# Altium schematic sheet main.SchDoc
size A2; SheetNumber: 1; SheetTotal: 1
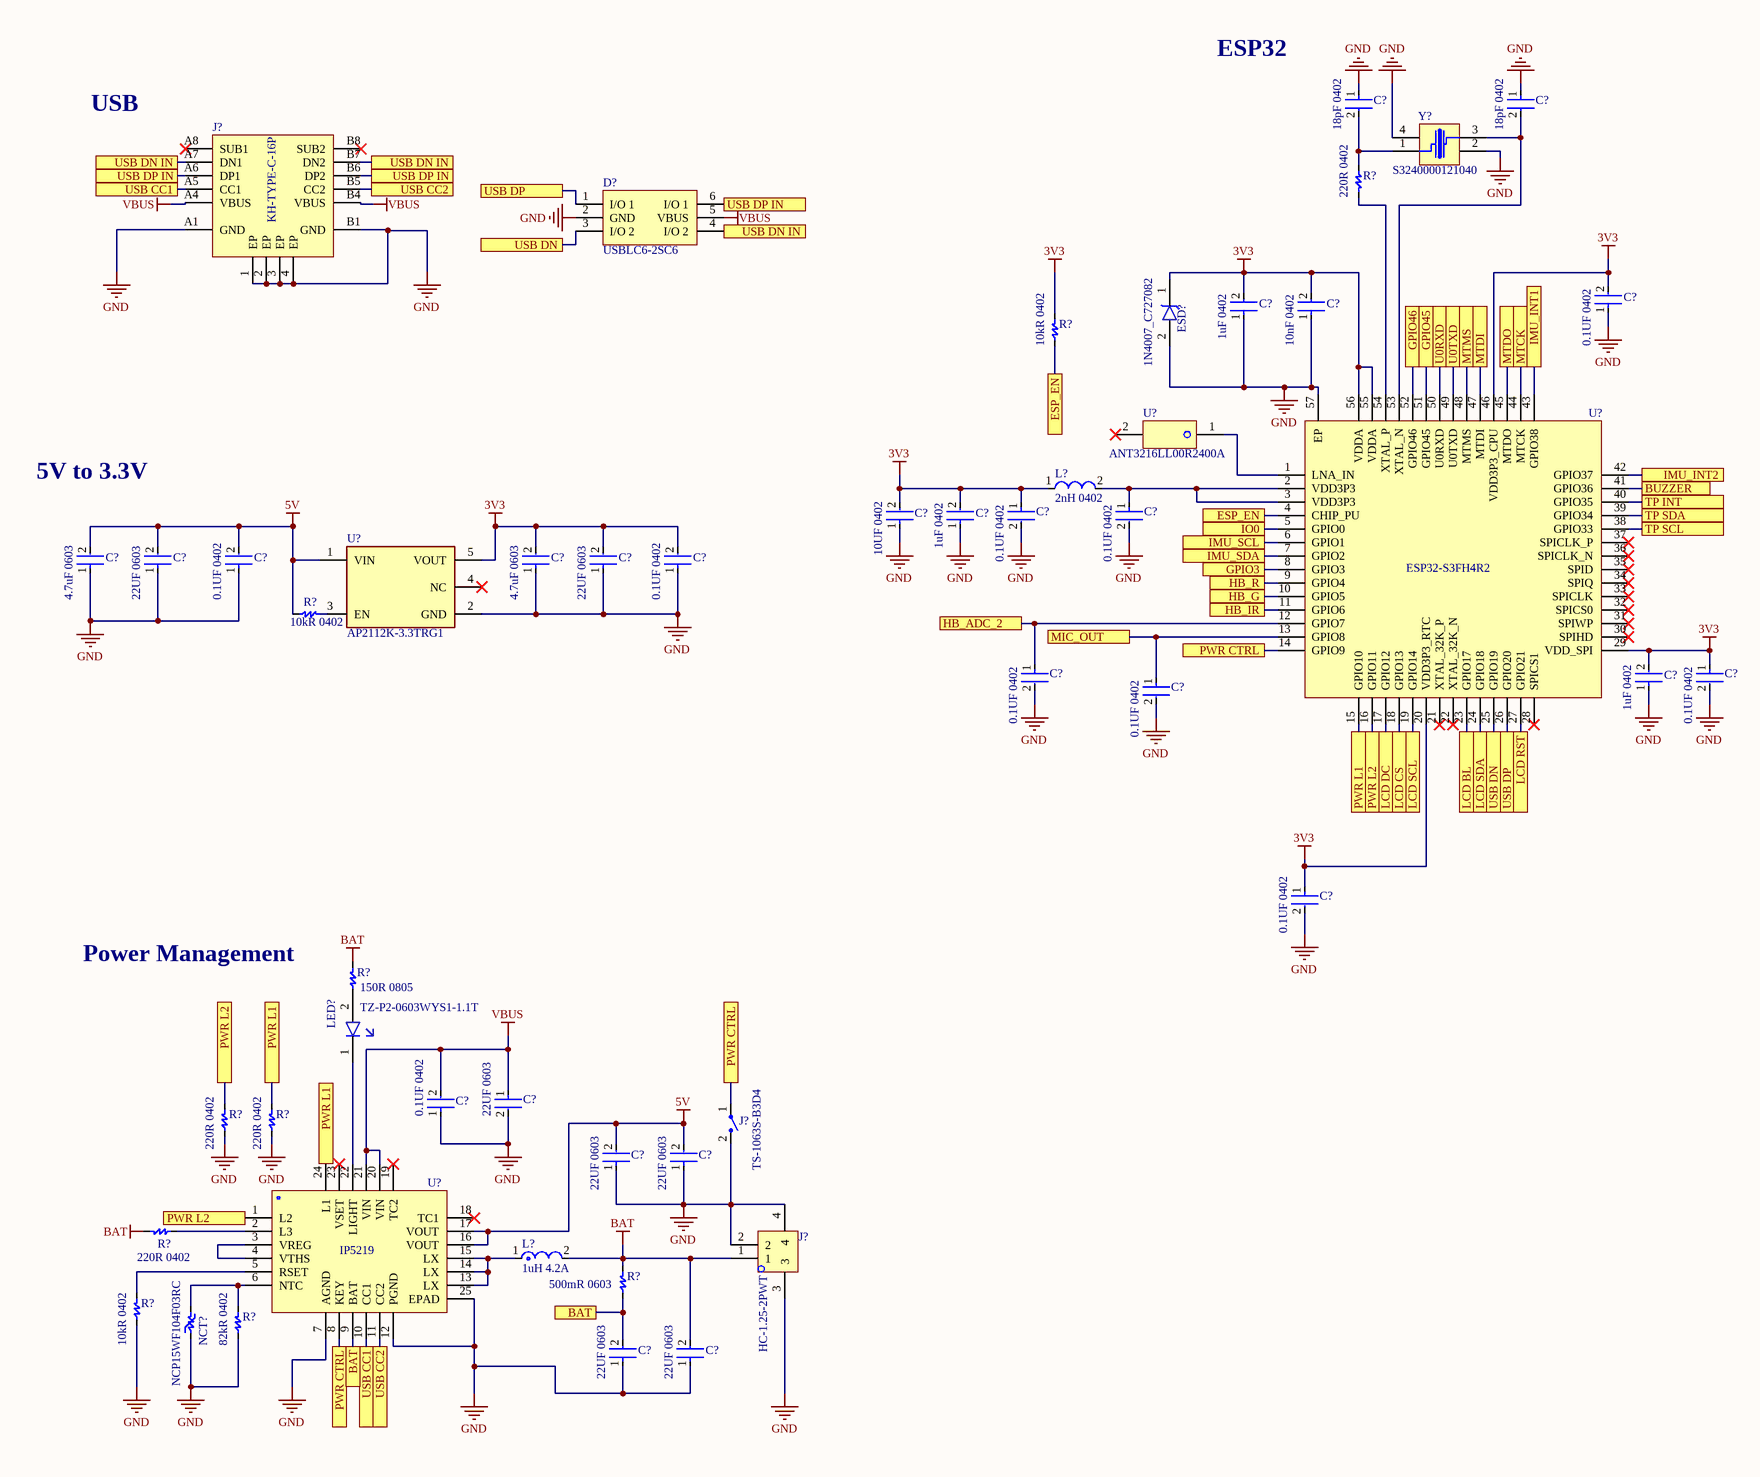
[diagram p0: main.SchDoc, left]
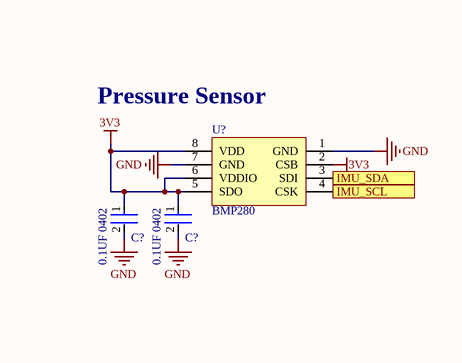
[diagram p1: main.SchDoc, right]

## Parts
(Parts that share a designator on the sheet are numbered #1, #2 ... from top to bottom, then left to right.)
C?#1  18pF 0402  [0402_C]
C?#2  18pF 0402  [0402_C]
C?#3  0.1UF 0402  [0402_C]
C?#4  0.1UF 0402  [0402_C]
C?#5  0.1UF 0402  [0402_C]
C?#6  1uF 0402  [0402_C]
C?#7  10nF 0402  [0402_C]
C?#8  0.1UF 0402  [0402_C]
C?#9  0.1UF 0402  [0402_C]
C?#10  10UF 0402  [0402_C]
C?#11  1uF 0402  [0402_C]
C?#12  4.7uF 0603  [0603_C]
C?#13  22UF 0603  [0603_C]
C?#14  0.1UF 0402  [0402_C]
C?#15  4.7uF 0603  [0603_C]
C?#16  22UF 0603  [0603_C]
C?#17  0.1UF 0402  [0402_C]
C?#18  0.1UF 0402  [0402_C]
C?#19  0.1UF 0402  [0402_C]
C?#20  0.1UF 0402  [0402_C]
C?#21  1uF 0402  [0402_C]
C?#22  0.1UF 0402  [0402_C]
C?#23  22UF 0603  [0603_C]
C?#24  0.1UF 0402  [0402_C]
C?#25  22UF 0603  [0603_C]
C?#26  22UF 0603  [0603_C]
C?#27  22UF 0603  [0603_C]
C?#28  22UF 0603  [0603_C]
D?  USBLC6-2SC6  [USBLC6-2SC6]
ESD?  1N4007_C727082  [1N4007_C727082]
J?#1  KH-TYPE-C-16P  [KH-TYPE-C-16P]
J?#2  TS-1063S-B3D4  [TS-1063S-B3D4]
J?#3  HC-1.25-2PWT  [HC-1.25-2PWT]
L?#1  2nH 0402  [0402_H]
L?#2  1uH 4.2A  [WPN252012H1R0MT]
LED?  TZ-P2-0603WYS1-1.1T  [TZ-P2-0603WYS1-1.1T]
NCT?  NCP15WF104F03RC  [0402_R]
R?#1  220R 0402  [0402_R]
R?#2  10kR 0402  [0402_R]
R?#3  10kR 0402  [0402_R]
R?#4  150R 0805  [0805_R]
R?#5  220R 0402  [0402_R]
R?#6  220R 0402  [0402_R]
R?#7  220R 0402  [0402_R]
R?#8  500mR 0603  [0603_R]
R?#9  10kR 0402  [0402_R]
R?#10  82kR 0402  [0402_R]
U?#1  BMP280  [BMP280]
U?#2  ESP32-S3FH4R2  [ESP32-S3FH4R2]
U?#3  ANT3216LL00R2400A  [ANT3216LL00R2400A]
U?#4  AP2112K-3.3TRG1  [AP2112K-3.3TRG1]
U?#5  IP5219  [IP5219]
Y?  S3240000121040  [S3240000121040]

## Ports
BAT, BUZZER, ESP_EN, GPIO3, GPIO45, GPIO46, HB_ADC_2, HB_G, HB_IR, HB_R, IMU_INT1, IMU_INT2, IMU_SCL, IMU_SDA, IO0, LCD BL, LCD CS, LCD DC, LCD RST, LCD SCL, LCD SDA, MIC_OUT, MTCK, MTDI, MTDO, MTMS, PWR CTRL, PWR L1, PWR L2, TP INT, TP SCL, TP SDA, U0RXD, U0TXD, USB CC1, USB CC2, USB DN, USB DN IN, USB DP, USB DP IN

## Nets
3V3: C?#3.1 C?#4.1 C?#5.2 C?#6.2 C?#7.2 C?#8.1 C?#10.2 C?#11.2 C?#15.2 C?#16.2 C?#17.2 C?#19.1 C?#21.2 C?#22.1 ESD?.1 L?#1.1 R?#2.2 U?#1.2(CSB) U?#1.5(SDO) U?#1.6(VDDIO) U?#1.8(VDD) U?#2.20(VDD3P3_RTC) U?#2.29(VDD_SPI) U?#2.46(VDD3P3_CPU) U?#2.55(VDDA) U?#2.56(VDDA) U?#4.5(VOUT)
5V: C?#12.2 C?#13.2 C?#14.2 C?#25.2 C?#26.2 R?#3.1 U?#4.1(VIN) U?#5.16(VOUT) U?#5.17(VOUT)
BAT: C?#28.2 J?#3.1 L?#2.2 R?#4.2 R?#7.2 R?#8.2
GND: C?#1.1 C?#2.1 C?#3.2 C?#4.2 C?#5.1 C?#6.1 C?#7.1 C?#8.2 C?#9.2 C?#10.1 C?#11.1 C?#12.1 C?#13.1 C?#14.1 C?#15.1 C?#16.1 C?#17.1 C?#18.2 C?#19.2 C?#20.2 C?#21.1 C?#22.2 C?#23.2 C?#24.1 C?#25.1 C?#26.1 C?#27.1 C?#28.1 D?.2(GND) ESD?.2 J?#1.1(EP) J?#1.2(EP) J?#1.3(EP) J?#1.4(EP) J?#1.A1(GND) J?#1.B1(GND) J?#2.2 J?#3.2 J?#3.3 J?#3.4 NCT?.1 R?#5.1 R?#6.1 R?#9.1 R?#10.1 U?#1.1(GND) U?#1.7(GND) U?#2.57(EP) U?#4.2(GND) U?#5.7(AGND) U?#5.12(PGND) U?#5.25(EPAD) Y?.2 Y?.4
VBUS: C?#23.1 C?#24.2 D?.5(VBUS) J?#1.A4(VBUS) J?#1.B4(VBUS) U?#5.20(VIN) U?#5.21(VIN)
BAT: C?#27.2 R?#8.1 U?#5.9(BAT) ; port BAT  [a separate net that carries the same name]
BUZZER: U?#2.41(GPIO36) ; port BUZZER
ESP_EN: R?#2.1 U?#2.4(CHIP_PU) ; port ESP_EN
GPIO3: U?#2.8(GPIO3) ; port GPIO3
GPIO45: U?#2.51(GPIO45) ; port GPIO45
GPIO46: U?#2.52(GPIO46) ; port GPIO46
HB_ADC_2: C?#18.1 U?#2.12(GPIO7) ; port HB_ADC_2
HB_G: U?#2.10(GPIO5) ; port HB_G
HB_IR: U?#2.11(GPIO6) ; port HB_IR
HB_R: U?#2.9(GPIO4) ; port HB_R
IMU_INT1: U?#2.43(GPIO38) ; port IMU_INT1
IMU_INT2: U?#2.42(GPIO37) ; port IMU_INT2
IMU_SCL: U?#1.4(CSK) U?#2.6(GPIO1) ; port IMU_SCL
IMU_SDA: U?#1.3(SDI) U?#2.7(GPIO2) ; port IMU_SDA
IO0: U?#2.5(GPIO0) ; port IO0
LCD BL: U?#2.23(GPIO17) ; port LCD BL
LCD CS: U?#2.18(GPIO13) ; port LCD CS
LCD DC: U?#2.17(GPIO12) ; port LCD DC
LCD RST: U?#2.27(GPIO21) ; port LCD RST
LCD SCL: U?#2.19(GPIO14) ; port LCD SCL
LCD SDA: U?#2.24(GPIO18) ; port LCD SDA
MIC_OUT: C?#20.1 U?#2.13(GPIO8) ; port MIC_OUT
MTCK: U?#2.44(MTCK) ; port MTCK
MTDI: U?#2.47(MTDI) ; port MTDI
MTDO: U?#2.45(MTDO) ; port MTDO
MTMS: U?#2.48(MTMS) ; port MTMS
PWR CTRL: J?#2.1 U?#2.14(GPIO9) U?#5.8(KEY) ; port PWR CTRL
PWR L1: R?#6.2 U?#2.15(GPIO10) U?#5.24(L1) ; port PWR L1
PWR L2: R?#5.2 U?#2.16(GPIO11) U?#5.1(L2) ; port PWR L2
TP INT: U?#2.40(GPIO35) ; port TP INT
TP SCL: U?#2.38(GPIO33) ; port TP SCL
TP SDA: U?#2.39(GPIO34) ; port TP SDA
U0RXD: U?#2.50(U0RXD) ; port U0RXD
U0TXD: U?#2.49(U0TXD) ; port U0TXD
USB CC1: J?#1.A5(CC1) U?#5.10(CC1) ; port USB CC1
USB CC2: J?#1.B5(CC2) U?#5.11(CC2) ; port USB CC2
USB DN: D?.3(I/O_2) U?#2.25(GPIO19) ; port USB DN
USB DN IN: D?.4(I/O_2) J?#1.A7(DN1) J?#1.B7(DN2) ; port USB DN IN
USB DP: D?.1(I/O_1) U?#2.26(GPIO20) ; port USB DP
USB DP IN: D?.6(I/O_1) J?#1.A6(DP1) J?#1.B6(DP2) ; port USB DP IN
NetC?#1_2: C?#1.2 R?#1.1 Y?.1
NetC?#2_2: C?#2.2 U?#2.53(XTAL_N) Y?.3
NetC?#9_1: C?#9.1 L?#1.2 U?#2.2(VDD3P3) U?#2.3(VDD3P3)
NetL?#2_1: L?#2.1 U?#5.13(LX) U?#5.14(LX) U?#5.15(LX)
NetLED?_1: LED?.1 U?#5.22(LIGHT)
NetLED?_2: LED?.2 R?#4.1
NetNCT?_2: NCT?.2 R?#10.2 U?#5.6(NTC)
NetR?#1_2: R?#1.2 U?#2.54(XTAL_P)
NetR?#3_2: R?#3.2 U?#4.3(EN)
NetR?#7_1: R?#7.1 U?#5.2(L3)
NetR?#9_2: R?#9.2 U?#5.5(RSET)
NetU?#2_1: U?#2.1(LNA_IN) U?#3.1
NetU?#5_3: U?#5.3(VREG) U?#5.4(VTHS)

Not connected (* = marked no-connect by the designer): J?#1 A8(SUB1)* B8(SUB2)*; U?#2 21(XTAL_32K_P)* 22(XTAL_32K_N)* 28(SPICS1)* 30(SPIHD)* 31(SPIWP)* 32(SPICS0)* 33(SPICLK)* 34(SPIQ)* 35(SPID)* 36(SPICLK_N)* 37(SPICLK_P)*; U?#3 2*; U?#4 4(NC)*; U?#5 18(TC1)* 19(TC2)* 23(VSET)*

## Notes on the sheet
- ESP32
- USB
- (near U?#1) Pressure Sensor
- 5V to 3.3V
- Power Management

## Library data of the parts
C?#1 C?#2 = CAP CER 18pF 50V X5R 0402: 18pF ±5% 50V; Manufacturer: FH; Manufacturer Part Number: 0402CG180J500NT; Supplier 1: LCSC; Category: Uncategorized; Supplier Part Number 1: C1549
C?#3-C?#5 C?#8 C?#9 C?#14 C?#17-C?#20 C?#22 C?#24 = CAP CER 0.1UF 25V X7R 0402: CGA Series 0402 100 nF 25 V ±10 % Tolerance X7R SMT Multilayer Ceramic Capacitor; Manufacturer: TDK; Manufacturer Part Number: CGA2B3X7R1E104K050BB; Tolerance: 10%; Capacitance: 100nF; Voltage Rating (DC): 25V; Supplier 1: Digi-Key; RoHS: Yes; Category: Ceramic Capacitors; Stock 1: 5051937; Pricing 1: 1=0.12, 10=0.084, 50=0.0478, 100=0.0395, 500=0.02772, 1000=0.02295, 2500=0.02136, 5000=0.01954 (USD); Mount: Surface Mount; Case/Package: 0402; Case Code (Metric): 1005; Case Code (Imperial): 0402; Weight: 2.3E-05oz; Min Operating Temperature: -55°C; Max Operating Temperature: 125°C; Packaging: Tape and Reel; Dielectric: X7R; Voltage: 25V; Voltage Rating: 25V; Package Quantity: 10000; Termination: SMD/SMT; Series: CGA; Length: 1mm; Width: 0.5mm; Height: 0.5mm; Depth: 0.5mm; Ratings: AEC-Q200; Lead Free: Lead Free; Reach SVHC Compliant: No; RoHS Compliant: Yes; ComponentLink1URL: https://datasheet.ciiva.com/24216/cga2b3x7r1e104k050bb-266280-24216396.pdf?src-supplier=Mouser; ComponentLink1Description: https://datasheet.ciiva.com/24216/cga2b3x7r1e104k050bb-266280-24216396.pdf?src-supplier=Mouser; ComponentLink2URL: https://datasheet.ciiva.com/22725/1735392-22725626.pdf?src-supplier=Element14; ComponentLink2Description: https://datasheet.ciiva.com/22725/1735392-22725626.pdf?src-supplier=Element14; ComponentLink3URL: https://datasheet.ciiva.com/28563/1735392-28563942.pdf?src-supplier=Element14; ComponentLink3Description: https://datasheet.ciiva.com/28563/1735392-28563942.pdf?src-supplier=Element14; ComponentLink4URL: https://datasheet.ciiva.com/23803/1936565-23803070.pdf?src-supplier=Newark; ComponentLink4Description: https://datasheet.ciiva.com/23803/1936565-23803070.pdf?src-supplier=Newark; Supplier Part Number 1: 445-6902-1-ND
C?#6 C?#11 C?#21 = CAP CER 1UF 25V X7R 0402: CAP CER 1UF 25V X5R 0402; Manufacturer: Samsung; Manufacturer Part Number: CL05A105KA5NQNC; Material: Ceramic; Tolerance: 10%; Supplier 1: Digi-Key; RoHS: Yes; Category: Ceramic Capacitors; Stock 1: 1706852; Pricing 1: 1=0.18, 10=0.131, 50=0.0742, 100=0.0615, 500=0.04312, 1000=0.0357, 2500=0.03323, 5000=0.0304 (USD); Mount: Surface Mount; Case/Package: 0402; Case Code (Metric): 1005; Case Code (Imperial): 0402; Min Operating Temperature: -55°C; Max Operating Temperature: 85°C; Package Quantity: 10000; Series: CL; Voltage Rating: 25V; Packaging: Tape and Reel; Construction: Flat; Capacitance: 1uF; Dielectric: X5R; Length: 1mm; Width: 0.02inch; Height: 0.5mm; Depth: 0.5mm; Thickness: 0.022inch; Radiation Hardening: No; Lead Free: Lead Free; RoHS Compliant: Yes; ComponentLink1URL: https://datasheet.ciiva.com/25720/cl05a105ka5nqnc-25720771.pdf?src-supplier=Digi-Key; ComponentLink1Description: https://datasheet.ciiva.com/25720/cl05a105ka5nqnc-25720771.pdf?src-supplier=Digi-Key; Supplier Part Number 1: 1276-1445-1-ND
C?#7 = CAP CER 10nF 16V X7R 0402: 0402 10 nF 16 V ±10 % Tolerance X7R SMT Multilayer Ceramic Capacitor; Manufacturer: Yageo; Manufacturer Part Number: CC0402KRX7R7BB103; Tolerance: 10%; Voltage Rating: 16V; Insulation Resistance: 10GR; Dissipation Factor: 3.5%; Supplier 1: Digi-Key; RoHS: Yes; Category: Ceramic Capacitors; Stock 1: 3203545; Pricing 1: 1=0.1, 10=0.016, 50=0.0088, 100=0.0071, 500=0.0051, 1000=0.004, 2500=0.00364, 5000=0.00335 (USD); Mount: Surface Mount; Case/Package: 0402; Number of Pins: 2; Case Code (Metric): 1005; Case Code (Imperial): 0402; Min Operating Temperature: -55°C; Max Operating Temperature: 125°C; Capacitance: 10nF; Dielectric: X7R; Package Quantity: 1; Packaging: Tape and Reel; Voltage Rating (DC): 16V; Termination: SMD/SMT; Series: CC; Length: 1mm; Width: 0.02inch; Height: 0.5mm; Thickness: 0.022inch; Depth: 0.5mm; Radiation Hardening: No; Reach SVHC Compliant: No; Lead Free: Lead Free; Halogen Free: Halogen Free; RoHS Compliant: Yes; ComponentLink1URL: https://datasheet.ciiva.com/143/mlccorderingcode-143951.pdf?src-supplier=Digi-Key; ComponentLink1Description: https://datasheet.ciiva.com/143/mlccorderingcode-143951.pdf?src-supplier=Digi-Key; ComponentLink2URL: https://datasheet.ciiva.com/143/mlccorderingcode-143950.pdf?src-supplier=Digi-Key; ComponentLink2Description: https://datasheet.ciiva.com/143/mlccorderingcode-143950.pdf?src-supplier=Digi-Key; ComponentLink3URL: https://datasheet.ciiva.com/143/upy-gphc-x7r-6-3v-to-50v-8-143952.pdf?src-supplier=Digi-Key; ComponentLink3Description: https://datasheet.ciiva.com/143/upy-gphc-x7r-6-3v-to-50v-8-143952.pdf?src-supplier=Digi-Key; ComponentLink4URL: https://datasheet.ciiva.com/8033/70765-8033655.pdf?src-supplier=Element14; ComponentLink4Description: https://datasheet.ciiva.com/8033/70765-8033655.pdf?src-supplier=Element14; ComponentLink5URL: https://datasheet.ciiva.com/7978/1489800-7978109.pdf?src-supplier=Element14; ComponentLink5Description: https://datasheet.ciiva.com/7978/1489800-7978109.pdf?src-supplier=Element14; ComponentLink6URL: https://datasheet.ciiva.com/28450/1489800-28450330.pdf?src-supplier=Element14; ComponentLink6Description: https://datasheet.ciiva.com/28450/1489800-28450330.pdf?src-supplier=Element14; ComponentLink7URL: https://datasheet.ciiva.com/8033/1489800-8033659.pdf?src-supplier=Element14; ComponentLink7Description: https://datasheet.ciiva.com/8033/1489800-8033659.pdf?src-supplier=Element14; ComponentLink8URL: https://datasheet.ciiva.com/8033/1489800-8033658.pdf?src-supplier=Element14; ComponentLink8Description: https://datasheet.ciiva.com/8033/1489800-8033658.pdf?src-supplier=Element14; ComponentLink9URL: https://datasheet.ciiva.com/5425/upy-gp-np0-16v-to-50v-8-3714-5425438.pdf?src-supplier=Mouser; ComponentLink9Description: https://datasheet.ciiva.com/5425/upy-gp-np0-16v-to-50v-8-3714-5425438.pdf?src-supplier=Mouser; Supplier Part Number 1: 311-1042-1-ND
C?#10 = CAP CER 10UF 10V X5R 0402: Ceramic Capacitor, Multilayer, Ceramic, 10V, 20% +Tol, 20% -Tol, X5R, 15% TC, 10uF, Surface Mount, 0402; Manufacturer: Samsung; Manufacturer Part Number: CL05A106MP5NUNC; Multilayer: Yes; Supplier 1: Digi-Key; RoHS: Yes; Category: Ceramic Capacitors; Stock 1: 2180252; Pricing 1: 1=0.18, 10=0.121, 50=0.0726, 100=0.0613, 500=0.04192, 1000=0.03708, 2500=0.03546, 5000=0.03224 (USD); Mount: Surface Mount; Number of Pins: 2; Dielectric Material: Ceramic; Package Shape: Rectangular; Size Code: 0402; Terminal Finish: Nickel; Min Operating Temperature: -55°C; Max Operating Temperature: 85°C; JESD-609 Code: e3; Capacitance: 10uF; Capacitor Type: Ceramic; Negative Tolerance: 20%; Package Style: SMTMeter; Packaging: Tape and Reel; Positive Tolerance: 20%; Rated DC Voltage (URdc): 10V; Temperature Characteristics Code: X5R; Termination: Wraparound; Length: 1mm; Width: 0.5mm; Height: 0.7mm; Reach SVHC Compliant: Yes; RoHS Compliant: Yes; ComponentLink1URL: https://datasheet.ciiva.com:443/pdfs/VipMasterIC/IC/SEMS/SEMS-S-A0008384515/SEMS-S-A0008872829-1.pdf?src-supplier=IHS+Markit; ComponentLink1Description: https://datasheet.ciiva.com:443/pdfs/VipMasterIC/IC/SEMS/SEMS-S-A0008384515/SEMS-S-A0008872829-1.pdf?src-supplier=IHS+Markit; ComponentLink2URL: https://datasheet.ciiva.com/25721/cl05a106mp5nunc-25721584.pdf?src-supplier=Digi-Key; ComponentLink2Description: https://datasheet.ciiva.com/25721/cl05a106mp5nunc-25721584.pdf?src-supplier=Digi-Key; ComponentLink3URL: https://datasheet.ciiva.com/26838/getdatasheetpartid-745310-26838170.pdf?src-supplier=Verical; ComponentLink3Description: https://datasheet.ciiva.com/26838/getdatasheetpartid-745310-26838170.pdf?src-supplier=Verical; Supplier Part Number 1: 1276-1450-1-ND
C?#12 C?#15 = CAP CER 4.7UF 10V X5R 0603: Manufacturer: Samsung; Manufacturer Part Number: CL10A475KP8NNNC; Tolerance: 10%; Supplier 1: Digi-Key; RoHS: Yes; Category: Ceramic Capacitors; Stock 1: 4529127; Pricing 1: 1=0.1, 10=0.043, 50=0.0236, 100=0.0194, 500=0.01382, 1000=0.01086 (USD); Mount: Surface Mount; Case/Package: 0603; Case Code (Metric): 1608; Case Code (Imperial): 0603; Min Operating Temperature: -55°C; Max Operating Temperature: 85°C; Package Quantity: 1; Packaging: Tape and Reel; Capacitance: 4.7uF; Voltage Rating: 10V; Dielectric: X5R; Series: CL; Construction: Flat; Length: 1.6mm; Width: 0.031inch; Height: 0.8mm; Thickness: 0.035inch; Depth: 0.8mm; Radiation Hardening: No; RoHS Compliant: Yes; ComponentLink1URL: https://datasheet.ciiva.com/25797/cl10a475kp8nnnc-25797520.pdf?src-supplier=Digi-Key; ComponentLink1Description: https://datasheet.ciiva.com/25797/cl10a475kp8nnnc-25797520.pdf?src-supplier=Digi-Key; ComponentLink2URL: https://datasheet.ciiva.com/26838/getdatasheetpartid-358676-26838384.pdf?src-supplier=Verical; ComponentLink2Description: https://datasheet.ciiva.com/26838/getdatasheetpartid-358676-26838384.pdf?src-supplier=Verical; ComponentLink3URL: https://datasheet.ciiva.com/16318/cl05b104kq5nnnc-16318245.pdf?src-supplier=Future+Electronics; ComponentLink3Description: https://datasheet.ciiva.com/16318/cl05b104kq5nnnc-16318245.pdf?src-supplier=Future+Electronics; Supplier Part Number 1: 1276-1044-1-ND
C?#13 C?#16 C?#23 C?#25-C?#28 = CAP CER 22UF 6.3V X5R 0603: 0603 22 uF 6.3 V ±20% Tolerance X5R SMT Multilayer Ceramic Capacitor; Manufacturer: Murata; Manufacturer Part Number: GRM188R60J226MEA0D; Voltage Rating: 6.3V; Supplier 1: Digi-Key; RoHS: Yes; Category: Ceramic Capacitors; Stock 1: 7341544; Pricing 1: 1=0.21, 10=0.144, 50=0.0864, 100=0.0729, 500=0.0499, 1000=0.04414 (USD); Mount: Surface Mount; Case/Package: 0603; Case Code (Metric): 1608; Case Code (Imperial): 0603; Weight: 0.000222oz; Min Operating Temperature: -55°C; Max Operating Temperature: 85°C; Packaging: Tape and Reel; Package Quantity: 1; Series: GRM; Capacitance: 22uF; Tolerance: 20%; Dielectric: X5R; Termination: SMD/SMT; Voltage Rating (DC): 6.3V; Length: 0.063inch; Width: 0.031inch; Height: 0.8mm; Thickness: 0.039inch; Lead Free: Lead Free; RoHS Compliant: Yes; Reach SVHC Compliant: No; ComponentLink1URL: https://datasheet.ciiva.com/29540/partnumbering-e-01-29540442.pdf?src-supplier=Digi-Key; ComponentLink1Description: https://datasheet.ciiva.com/29540/partnumbering-e-01-29540442.pdf?src-supplier=Digi-Key; ComponentLink2URL: https://datasheet.ciiva.com/29540/partnumbering-e-01-29540441.pdf?src-supplier=Digi-Key; ComponentLink2Description: https://datasheet.ciiva.com/29540/partnumbering-e-01-29540441.pdf?src-supplier=Digi-Key; ComponentLink3URL: https://datasheet.ciiva.com/29540/partnumbering-e-01-29540443.pdf?src-supplier=Digi-Key; ComponentLink3Description: https://datasheet.ciiva.com/29540/partnumbering-e-01-29540443.pdf?src-supplier=Digi-Key; Supplier Part Number 1: 490-7611-1-ND
D? = USBLC6-2SC6: Trans Voltage Suppressor Diode, 5V V(RWM), Unidirectional, 1 Element, Silicon; Manufacturer: TECH PUBLIC; Package Body Material: Plastic; Additional Feature: HIGH RELIABILITY; Min Breakdown Voltage: 6V; Number of Elements: 1; Clamping Voltage-Max: 17V; Reference Standard: IEC-61000-4-2; Qualification Status: Not Qualified; Supplier 1: LCSZ; Manufacturer Part Number: USBLC6-2SC6; RoHS: Yes; Category: TVS Diodes; Stock 1: 273114; Pricing 1: 1=0.59, 10=0.507, 50=0.507, 100=0.379, 500=0.298, 1000=0.23, 3000=0.209, 9000=0.182, 10000=0.182, 24000=0.173, 45000=0.17 (USD); Number of Pins: 6; Package Shape: Rectangular; Terminal Finish: Tin; Diode Element Material: SILICON; Min Operating Temperature: -40°C; Max Operating Temperature: 125°C; JESD-609 Code: e3; Polarity: Unidirectional; Package Style: SMALL OUTLINEMeter; Diode Type: TRANS VOLTAGE SUPPRESSOR; JESD-30 Code: R-PDSO-G6; Moisture Sensitivity Level: 1; Rep Pk Reverse Voltage-Max: 5V; Surface Mount: Yes; Technology: AVALANCHE; Terminal Form: Gull Wing; Terminal Position: DUAL; Peak Reflow Temperature (Cel): 260°C; Reach SVHC Compliant: Yes; RoHS Compliant: Yes; ComponentLink1URL: https://datasheet.ciiva.com:443/pdfs/VipMasterIC/IC/SGST/SGSTS30336/SGSTS30336-1.pdf?src-supplier=IHS+Markit; ComponentLink1Description: https://datasheet.ciiva.com:443/pdfs/VipMasterIC/IC/SGST/SGSTS30336/SGSTS30336-1.pdf?src-supplier=IHS+Markit; ComponentLink2URL: https://datasheet.ciiva.com/1268/1690354-1268384.pdf?src-supplier=Element14; ComponentLink2Description: https://datasheet.ciiva.com/1268/1690354-1268384.pdf?src-supplier=Element14; ComponentLink3URL: https://datasheet.ciiva.com/4508/cd00050750-113117-4508433.pdf?src-supplier=Mouser; ComponentLink3Description: https://datasheet.ciiva.com/4508/cd00050750-113117-4508433.pdf?src-supplier=Mouser; ComponentLink4URL: https://datasheet.ciiva.com/15143/getdatasheetpartid-148465-15143789.pdf?src-supplier=Verical; ComponentLink4Description: https://datasheet.ciiva.com/15143/getdatasheetpartid-148465-15143789.pdf?src-supplier=Verical; ComponentLink5URL: https://datasheet.ciiva.com/16200/cd00050750-16200026.pdf?src-supplier=Future+Electronics; ComponentLink5Description: https://datasheet.ciiva.com/16200/cd00050750-16200026.pdf?src-supplier=Future+Electronics; ComponentLink6URL: https://datasheet.ciiva.com/41444/001184109-da-01-en-ic-esd-protecti-usblc6-2sc6-sot-23-6-stm-41444156.pdf?src-supplier=Conrad; ComponentLink6Description: https://datasheet.ciiva.com/41444/001184109-da-01-en-ic-esd-protecti-usblc6-2sc6-sot-23-6-stm-41444156.pdf?src-supplier=Conrad; Supplier Part Number 1: 511-USBLC6-2SC6
ESD? = 1N4007_C727082: 独立式 直流反向耐压(Vr)：1kV 平均整流电流(Io)：1A 正向压降(Vf)：1.1V@1A; Manufacturer: TWGMC; Supplier 1: szlc; Manufacturer Part Number: 1N4007_C727082; Supplier Part Number 1: C727082
J?#1 = KH-TYPE-C-16P: Manufacturer: Shenzhen Kinghelm Elec; Supplier 1: LCSC; Manufacturer Part Number: KH-TYPE-C-16P; RoHS: No; Category: Uncategorized; Stock 1: 64931; Pricing 1: 5=0.0813, 50=0.0658, 150=0.0577, 1000=0.0511, 2000=0.0488, 5000=0.0473 (USD); Supplier Part Number 1: C709357
J?#2 = TS-1063S-B3D4: 轻触开关3.0*2.5侧按贴片带柱小小龟250gf; Manufacturer: Yuandi; Supplier 1: LCSC; Manufacturer Part Number: TS-1063S-B3D4; RoHS: No; Category: Uncategorized; Stock 1: 8210; Pricing 1: 5=0.182, 50=0.1453, 150=0.1295, 500=0.1099, 2500=0.1011, 4000=0.0959 (USD); Supplier Part Number 1: C498291
J?#3 = HC-1.25-2PWT: 1.25mm 1x2P Connector; Manufacturer: HCTL; Supplier 1: LCSC; Manufacturer Part Number: HC-1.25-2PWT; Category: Uncategorized; Supplier Part Number 1: C2845379
L?#1 = 2nH 0402: General Purpose Inductor, 0.002uH, 15%, 1 Element, Air-Core, SMD, 0402; Manufacturer: Murata; Manufacturer Part Number: LQG15HS2N0S02D; Core Material: Air; Case/Size Code: 0402; DC Resistance (DCR): 90mR; Inductor Application: RF INDUCTOR; Number of Functions: 1; Quality Factor-Min (at L-nom): 8; Rated Current-Max: 900mA; Self Resonant Frequency: 6GHz; Shape/Size Description: RECTANGULAR PACKAGE; Shielding: Unshielded; Test Frequency: 100MHz; Package Height: 0.5mm; Package Length: 1mm; Supplier 1: Digi-Key; RoHS: Yes; Category: Fixed Inductors; Stock 1: 37250; Pricing 1: 1=0.1, 10=0.053, 25=0.0472, 50=0.0402, 100=0.0355, 250=0.03248, 500=0.02954, 1000=0.02482, 2500=0.02127 (USD); Number of Pins: 2; Terminal Finish: Nickel; Min Operating Temperature: -55°C; Max Operating Temperature: 125°C; Tolerance: 15%; JESD-609 Code: e3; Construction: Multilayer Chip; Inductance-Nom (L): 0.002uH; Inductor Type: GENERAL PURPOSE INDUCTOR; Package Style: SMTMeter; Packaging: Tape and Reel; Surface Mount: Yes; Terminal Placement: Dual Ended; Termination: Wraparound; Package Width: 0.5mm; Reach SVHC Compliant: Yes; RoHS Compliant: Yes; ComponentLink1URL: https://datasheet.ciiva.com:443/pdfs/VipMasterIC/IC/MURE/MURE-S-A0004278247/MURE-S-A0004278617-1.pdf?src-supplier=IHS+Markit; ComponentLink1Description: https://datasheet.ciiva.com:443/pdfs/VipMasterIC/IC/MURE/MURE-S-A0004278247/MURE-S-A0004278617-1.pdf?src-supplier=IHS+Markit; ComponentLink2URL: https://datasheet.ciiva.com/6705/l0075s0083lqg15hs-6705247.pdf?src-supplier=Digi-Key; ComponentLink2Description: https://datasheet.ciiva.com/6705/l0075s0083lqg15hs-6705247.pdf?src-supplier=Digi-Key; ComponentLink3URL: https://datasheet.ciiva.com/6705/l0075s0083lqg15hs-6705246.pdf?src-supplier=Digi-Key; ComponentLink3Description: https://datasheet.ciiva.com/6705/l0075s0083lqg15hs-6705246.pdf?src-supplier=Digi-Key; ComponentLink4URL: https://datasheet.ciiva.com/6705/l0075s0083lqg15hs-6705245.pdf?src-supplier=Digi-Key; ComponentLink4Description: https://datasheet.ciiva.com/6705/l0075s0083lqg15hs-6705245.pdf?src-supplier=Digi-Key; ComponentLink5URL: https://datasheet.ciiva.com/8510/l0075s0083lqg15hs-8510843.pdf?src-supplier=Avnet; ComponentLink5Description: https://datasheet.ciiva.com/8510/l0075s0083lqg15hs-8510843.pdf?src-supplier=Avnet; Supplier Part Number 1: 490-6569-1-ND
L?#2 = WPN252012H1R0MT: General Purpose Inductor, 1uH, 20%, 1 Element, Ferrite-Core, SMD, 1008; Manufacturer: Sunlord; Supplier 1: Digi-Key; Manufacturer Part Number: WPN252012H1R0MT; RoHS: Yes; Category: Fixed Inductors; Stock 1: 4988; Pricing 1: 1=0.44, 10=0.389, 25=0.3612, 50=0.3056, 100=0.2778, 250=0.26108, 500=0.23332, 1000=0.18887 (USD); Supplier Part Number 1: 3442-WPN252012H1R0MTCT-ND
LED? = TZ-P2-0603WYS1-1.1T: 发光颜色：白灯 透镜颜色：黄色 主波长：464nm 色温：30000K~40000K 功率：90mW 发光角度：120° 安装方式：侧贴 工作温度：-40℃~+80℃; Manufacturer: TUOZHAN; Supplier 1: LCSC; Manufacturer Part Number: TZ-P2-0603WYS1-1.1T; Category: Uncategorized; Supplier Part Number 1: C916072
NCT? = NCP15WF104F03RC: NTC Thermistor, 100000ohm, Surface Mount; Manufacturer: Murata; Tolerance: 1%; Rated Power Dissipation (P): 100mW; Rated Temperature: 25°C; Resistance: 100kR; Thermistor Application: TEMPERATURE SENSING; Supplier 1: Digi-Key; Manufacturer Part Number: NCP15WF104F03RC; RoHS: Yes; Category: Thermistors; Stock 1: 1461604; Pricing 1: 1=0.13, 10=0.111, 25=0.0972, 50=0.0912, 100=0.0777, 500=0.06428, 1000=0.05381, 5000=0.04783 (USD); Mount: Surface Mount; Number of Pins: 2; Package Shape: Rectangular; Terminal Finish: Tin; Min Operating Temperature: -40°C; Max Operating Temperature: 125°C; JESD-609 Code: e3; Resistor Type: NTC THERMISTOR; Packaging: Tape and Reel; Terminal Placement: Dual Ended; Termination: Wraparound; Reach SVHC Compliant: Yes; RoHS Compliant: Yes; ComponentLink1URL: https://datasheet.ciiva.com:443/pdfs/VipMasterIC/IC/MURE/MURE-S-A0006155060/MURE-S-A0006138549-1.pdf?src-supplier=IHS+Markit; ComponentLink1Description: https://datasheet.ciiva.com:443/pdfs/VipMasterIC/IC/MURE/MURE-S-A0006155060/MURE-S-A0006138549-1.pdf?src-supplier=IHS+Markit; ComponentLink2URL: https://datasheet.ciiva.com/30488/0900766b81259d06-30488279.pdf?src-supplier=Rs; ComponentLink2Description: https://datasheet.ciiva.com/30488/0900766b81259d06-30488279.pdf?src-supplier=Rs; ComponentLink3URL: https://datasheet.ciiva.com/2848/r44e-2848227.pdf?src-supplier=Digi-Key; ComponentLink3Description: https://datasheet.ciiva.com/2848/r44e-2848227.pdf?src-supplier=Digi-Key; ComponentLink4URL: https://datasheet.ciiva.com/2848/r44e-2848226.pdf?src-supplier=Digi-Key; ComponentLink4Description: https://datasheet.ciiva.com/2848/r44e-2848226.pdf?src-supplier=Digi-Key; ComponentLink5URL: https://datasheet.ciiva.com/2848/r44e-2848228.pdf?src-supplier=Digi-Key; ComponentLink5Description: https://datasheet.ciiva.com/2848/r44e-2848228.pdf?src-supplier=Digi-Key; ComponentLink6URL: https://datasheet.ciiva.com/3280/l0770c-3280489.pdf?src-supplier=Avnet; ComponentLink6Description: https://datasheet.ciiva.com/3280/l0770c-3280489.pdf?src-supplier=Avnet; ComponentLink7URL: https://datasheet.ciiva.com/17993/getdatasheetpartid-318160-17993383.pdf?src-supplier=Verical; ComponentLink7Description: https://datasheet.ciiva.com/17993/getdatasheetpartid-318160-17993383.pdf?src-supplier=Verical; Supplier Part Number 1: 490-4803-1-ND
R?#1 R?#5-R?#7 = RES 220 OHM 1% 1/16W 0402: Res Thick Film 0402 220 Ohm 1% 0.063W ?100ppm/?C Molded SMD Paper T/R; Manufacturer: Yageo; Manufacturer Part Number: RC0402FR-07220RL; Power Rating: 62.5mW; Voltage Rating: 50V; Temperature Coefficient: 100ppm/°C; Max Power Dissipation: 63mW; Supplier 1: Digi-Key; RoHS: Yes; Category: Chip SMD Resistors; Stock 1: 1651787; Pricing 1: 1=0.1, 10=0.015, 50=0.009, 100=0.0074, 500=0.00492, 1000=0.00421, 5000=0.003 (USD); Case/Package: 0402; Number of Pins: 2; Case Code (Imperial): 0402; Case Code (Metric): 1005; Size Code: 0402; Min Operating Temperature: -55°C; Max Operating Temperature: 155°C; Series: RC; Resistance: 220R; Tolerance: 1%; Packaging: Tape and Reel; Voltage Rating (DC): 50V; Package Quantity: 1; Termination: SMD/SMT; Resistor Type: Thick Film; Number of Terminations: 2; Features: Moisture Resistant; Resistance Tolerance: 1%; Construction: Rectangular; Technology: THICK FILM; Length: 0.039inch; Width: 0.02inch; Height: 0.016inch; Depth: 0.5mm; Reach SVHC Compliant: No; Lead Free: Lead Free; Military Standard: Not; RoHS Compliant: Yes; ComponentLink1URL: https://datasheet.ciiva.com/2453/pyu-r-int-thick-7-2453461.pdf?src-supplier=Digi-Key; ComponentLink1Description: https://datasheet.ciiva.com/2453/pyu-r-int-thick-7-2453461.pdf?src-supplier=Digi-Key; ComponentLink2URL: https://datasheet.ciiva.com/2453/pyu-r-int-thick-7-2453462.pdf?src-supplier=Digi-Key; ComponentLink2Description: https://datasheet.ciiva.com/2453/pyu-r-int-thick-7-2453462.pdf?src-supplier=Digi-Key; ComponentLink3URL: https://datasheet.ciiva.com/2453/pyu-r-int-thick-7-2453460.pdf?src-supplier=Digi-Key; ComponentLink3Description: https://datasheet.ciiva.com/2453/pyu-r-int-thick-7-2453460.pdf?src-supplier=Digi-Key; Supplier Part Number 1: 311-220LRCT-ND
R?#2 R?#3 R?#9 = RES 10k OHM 1% 1/16W 0402: Fixed Resistor, Metal Glaze/thick Film, 0.0625W, 10000ohm, 50V, 1% +/-Tol, 100ppm/Cel, Surface Mount, 0402; Manufacturer: Yageo; Manufacturer Part Number: RC0402FR-0710KL; Additional Feature: LASER TRIMMABLE; Rated Power Dissipation (P): 62.5mW; Rated Temperature: 70°C; Temperature Coefficient: 100ppm/°C; Package Height: 0.35mm; Package Length: 1mm; Package Width: 0.5mm; Supplier 1: Mouser; RoHS: Yes; Category: Chip SMD Resistors; Stock 1: 22433038; Pricing 1: 1=0.1, 10=0.015, 50=0.015, 100=0.008, 1000=0.005, 2500=0.003, 10000=0.002 (USD); Mount: Surface Mount; Number of Pins: 2; Package Shape: Rectangular; Size Code: 0402; Terminal Finish: Nickel; Min Operating Temperature: -55°C; Max Operating Temperature: 155°C; Tolerance: 1%; JESD-609 Code: e3; Termination: Wraparound; Resistor Type: FIXED RESISTOR; Construction: Chip; Package Style: SMTMeter; Packaging: Tape and Reel; Resistance: 10kR; Technology: METAL GLAZE/THICK FILM; Working Voltage: 50V; Reach SVHC Compliant: Yes; RoHS Compliant: Yes; ComponentLink1URL: https://datasheet.ciiva.com:443/pdfs/VipMasterIC/IC/YAGO/YAGO-S-A0008145938/YAGO-S-A0008145938-1.pdf?src-supplier=IHS+Markit; ComponentLink1Description: https://datasheet.ciiva.com:443/pdfs/VipMasterIC/IC/YAGO/YAGO-S-A0008145938/YAGO-S-A0008145938-1.pdf?src-supplier=IHS+Markit; ComponentLink2URL: https://datasheet.ciiva.com/7660/38568-7660787.pdf?src-supplier=Element14; ComponentLink2Description: https://datasheet.ciiva.com/7660/38568-7660787.pdf?src-supplier=Element14; ComponentLink3URL: https://datasheet.ciiva.com/12667/pyu-rc0402-51-rohs-l-6-r-12667067.pdf?src-supplier=Mouser; ComponentLink3Description: https://datasheet.ciiva.com/12667/pyu-rc0402-51-rohs-l-6-r-12667067.pdf?src-supplier=Mouser; ComponentLink4URL: https://datasheet.ciiva.com/7849/1784430-7849815.pdf?src-supplier=Element14; ComponentLink4Description: https://datasheet.ciiva.com/7849/1784430-7849815.pdf?src-supplier=Element14; ComponentLink5URL: https://datasheet.ciiva.com/7849/1686128-7849814.pdf?src-supplier=Element14; ComponentLink5Description: https://datasheet.ciiva.com/7849/1686128-7849814.pdf?src-supplier=Element14; ComponentLink6URL: https://datasheet.ciiva.com/7983/1018594-7983486.pdf?src-supplier=Element14; ComponentLink6Description: https://datasheet.ciiva.com/7983/1018594-7983486.pdf?src-supplier=Element14; ComponentLink7URL: https://datasheet.ciiva.com/22747/1018594-22747512.pdf?src-supplier=Element14; ComponentLink7Description: https://datasheet.ciiva.com/22747/1018594-22747512.pdf?src-supplier=Element14; ComponentLink8URL: https://datasheet.ciiva.com/7849/1784430-7849813.pdf?src-supplier=Element14; ComponentLink8Description: https://datasheet.ciiva.com/7849/1784430-7849813.pdf?src-supplier=Element14; Supplier Part Number 1: 603-RC0402FR-0710KL
R?#4 = RES 150 OHM 1% 125mW 0805: 电阻类型：厚膜电阻 阻值：150Ω 精度：±1% 功率：125mW 温度系数：±100ppm/℃; Manufacturer: Royal Electronic Factory; Manufacturer Part Number: 0805W8F1500T5E; Supplier 1: Mouser; RoHS: No; Category: Uncategorized; Pricing 1: 5000=0.002, 10000=0.002 (USD); Supplier Part Number 1: 303-0805W8F1500T5E
R?#8 = RES 500m OHM 1% 1/16W 0603: Thick Film Resistors - SMD 0603 1/10W 1% 0.5R T/R-5000; Manufacturer: Royal Electronic Factory; Manufacturer Part Number: 0603WAF500LT5E; Supplier 1: Mouser; RoHS: No; Category: Uncategorized; Pricing 1: 10000=0.06 (USD); Supplier Part Number 1: 303-0603WAF500LT5E
R?#10 = RES 82k OHM 1% 1/16W 0402: Fixed Resistor, Metal Glaze/thick Film, 0.0625W, 82000ohm, 50V, 1% +/-Tol, 100ppm/Cel, Surface Mount, 0402; Manufacturer: Yageo; Manufacturer Part Number: RC0402FR-0782KL; Additional Feature: LASER TRIMMABLE; Rated Power Dissipation (P): 62.5mW; Rated Temperature: 70°C; Temperature Coefficient: 100ppm/°C; Package Height: 0.35mm; Package Length: 1mm; Package Width: 0.5mm; Supplier 1: Digi-Key; RoHS: Yes; Category: Chip SMD Resistors; Stock 1: 420587; Pricing 1: 1=0.1, 10=0.014, 50=0.0084, 100=0.007, 500=0.00464, 1000=0.00396, 5000=0.00282 (USD); Mount: Surface Mount; Number of Pins: 2; Package Shape: Rectangular; Size Code: 0402; Terminal Finish: Nickel; Min Operating Temperature: -55°C; Max Operating Temperature: 155°C; Tolerance: 1%; JESD-609 Code: e3; Termination: Wraparound; Resistor Type: FIXED RESISTOR; Construction: Chip; Package Style: SMTMeter; Packaging: Tape and Reel; Resistance: 82kR; Technology: METAL GLAZE/THICK FILM; Working Voltage: 50V; Reach SVHC Compliant: Yes; RoHS Compliant: Yes; ComponentLink1URL: https://datasheet.ciiva.com:443/pdfs/VipMasterIC/IC/YAGO/YAGO-S-A0008145938/YAGO-S-A0008145938-1.pdf?src-supplier=IHS+Markit; ComponentLink1Description: https://datasheet.ciiva.com:443/pdfs/VipMasterIC/IC/YAGO/YAGO-S-A0008145938/YAGO-S-A0008145938-1.pdf?src-supplier=IHS+Markit; ComponentLink2URL: https://datasheet.ciiva.com/11808/0900766b80c66297-11808835.pdf?src-supplier=Rs; ComponentLink2Description: https://datasheet.ciiva.com/11808/0900766b80c66297-11808835.pdf?src-supplier=Rs; ComponentLink3URL: https://datasheet.ciiva.com/2491/pyu-r-int-thick-7-2491346.pdf?src-supplier=Digi-Key; ComponentLink3Description: https://datasheet.ciiva.com/2491/pyu-r-int-thick-7-2491346.pdf?src-supplier=Digi-Key; ComponentLink4URL: https://datasheet.ciiva.com/2491/pyu-r-int-thick-7-2491347.pdf?src-supplier=Digi-Key; ComponentLink4Description: https://datasheet.ciiva.com/2491/pyu-r-int-thick-7-2491347.pdf?src-supplier=Digi-Key; ComponentLink5URL: https://datasheet.ciiva.com/2491/pyu-r-int-thick-7-2491345.pdf?src-supplier=Digi-Key; ComponentLink5Description: https://datasheet.ciiva.com/2491/pyu-r-int-thick-7-2491345.pdf?src-supplier=Digi-Key; ComponentLink6URL: https://datasheet.ciiva.com/7850/1018594-7850106.pdf?src-supplier=Element14; ComponentLink6Description: https://datasheet.ciiva.com/7850/1018594-7850106.pdf?src-supplier=Element14; ComponentLink7URL: https://datasheet.ciiva.com/7850/1018594-7850105.pdf?src-supplier=Element14; ComponentLink7Description: https://datasheet.ciiva.com/7850/1018594-7850105.pdf?src-supplier=Element14; ComponentLink8URL: https://datasheet.ciiva.com/15189/getdatasheetpartid-327788-15189514.pdf?src-supplier=Verical; ComponentLink8Description: https://datasheet.ciiva.com/15189/getdatasheetpartid-327788-15189514.pdf?src-supplier=Verical; Supplier Part Number 1: 311-82.0KLRCT-ND
U?#1 = BMP280: SENSOR PRESSURE ABS; Manufacturer: Bosch; Supplier 1: LCSC; Manufacturer Part Number: BMP280; RoHS: No; Category: Pressure Sensors; Stock 1: 12813; Pricing 1: 1=1.6116, 10=1.4526, 30=1.3396, 100=1.1519, 500=1.1041, 1000=1.0851 (USD); ComponentLink1URL: https://ae-bst.resource.bosch.com/media/_tech/media/datasheets/BST-BMP280-DS001.pdf?src-supplier=Digi-Key; ComponentLink1Description: https://ae-bst.resource.bosch.com/media/_tech/media/datasheets/BST-BMP280-DS001.pdf?src-supplier=Digi-Key; ComponentLink2URL: https://datasheet.octopart.com/BMP280-Bosch-Sensortec-datasheet-121363206.pdf?src-supplier=LKR; ComponentLink2Description: https://datasheet.octopart.com/BMP280-Bosch-Sensortec-datasheet-121363206.pdf?src-supplier=LKR; Supplier Part Number 1: C83291
U?#2 = ESP32-S3FH4R2: 频率：2.4GHz 发射功率：21dBm 核心处理器：ESP32-S3R8; Manufacturer: Espressif Systems; Supplier 1: Mouser; Manufacturer Part Number: ESP32-S3FH4R2; RoHS: No; Stock 1: 3353; Pricing 1: 1=2.52, 10=2.52, 50=2.52, 100=2.52, 1000=2.52, 10000=2.52 (USD); Supplier Part Number 1: 356-ESP32-S3FH4R2
U?#3 = ANT3216LL00R2400A: 天线类型：芯片天线 中心频点：2.45GHz 带宽：160MHz 峰值增益：5.05dBi 极化方式：线性 功率容量：1W 2.4 GHz - 2.5 GHz; Manufacturer: Yageo; Manufacturer Part Number: ANT3216LL00R2400A; Category: RF Antennas
U?#4 = AP2112K-3.3TRG1: Fixed Positive LDO Regulator, 3.3V, 0.4V Dropout, CMOS, PDSO5; Manufacturer: Diodes; Package Body Material: Plastic; Dropout Voltage1-Max: 400mV; Dropout Voltage1-Nom: 250mV; Input Voltage Absolute-Max: 6.5V; Max Input Voltage: 6V; Min Input Voltage: 2.5V; Line Regulation-Max: 0.00561%; Load Regulation-Max: 0.0198%; Number of Functions: 1; Output Current1-Max: 600mA; Output Voltage1-Max: 3.3495V; Output Voltage1-Min: 3.2505V; Package Equivalence Code: TSOP5/6,.11,37; Regulator Type: FIXED POSITIVE SINGLE OUTPUT LDO REGULATOR; Voltage Tolerance-Max: 1.5%; Qualification Status: Not Qualified; Supplier 1: Mouser; Manufacturer Part Number: AP2112K-3.3TRG1; RoHS: Yes; Category: Voltage Regulators - Linear; Stock 1: 408745; Pricing 1: 1=0.37, 10=0.276, 50=0.276, 100=0.186, 500=0.154, 1000=0.116, 3000=0.099, 9000=0.092, 10000=0.092, 24000=0.087 (USD); Package Code: LSSOP; Number of Pins: 5; Package Shape: Rectangular; Terminal Finish: Tin; Min Operating Temperature: -40°C; Max Operating Temperature: 85°C; JESD-609 Code: e3; Adjustability: FIXED; JESD-30 Code: R-PDSO-G5; Moisture Sensitivity Level: 3; Number of Outputs: 1; Operating Temperature, TJ-Max: 85°C; Operating Temperature, TJ-Min: -40°C; Output Voltage1-Nom: 3.3V; Package Style: SMALL OUTLINE, LOW PROFILE, SHRINK PITCHMeter; Packaging: Tape and Reel; Surface Mount: Yes; Technology: CMOS; Terminal Form: Gull Wing; Terminal Position: DUAL; Length: 2.92mm; Width: 1.6mm; Height - Seated (Max): 1.45mm; Terminal Pitch: 0.95mm; Reach SVHC Compliant: Yes; RoHS Compliant: Yes; ComponentLink1URL: https://datasheet.ciiva.com:443/pdfs/VipMasterIC/IC/DIOD/DIOD-S-A0003551552/DIOD-S-A0003551552-1.pdf?src-supplier=IHS+Markit; ComponentLink1Description: https://datasheet.ciiva.com:443/pdfs/VipMasterIC/IC/DIOD/DIOD-S-A0003551552/DIOD-S-A0003551552-1.pdf?src-supplier=IHS+Markit; ComponentLink2URL: https://datasheet.ciiva.com/30016/ap2112-30016792.pdf?src-supplier=Avnet; ComponentLink2Description: https://datasheet.ciiva.com/30016/ap2112-30016792.pdf?src-supplier=Avnet; ComponentLink3URL: https://datasheet.ciiva.com/29569/ap2112-29569918.pdf?src-supplier=Digi-Key; ComponentLink3Description: https://datasheet.ciiva.com/29569/ap2112-29569918.pdf?src-supplier=Digi-Key; ComponentLink4URL: https://datasheet.ciiva.com/29569/ap2112-29569919.pdf?src-supplier=Digi-Key; ComponentLink4Description: https://datasheet.ciiva.com/29569/ap2112-29569919.pdf?src-supplier=Digi-Key; ComponentLink5URL: https://datasheet.ciiva.com/29569/ap2112-29569917.pdf?src-supplier=Digi-Key; ComponentLink5Description: https://datasheet.ciiva.com/29569/ap2112-29569917.pdf?src-supplier=Digi-Key; Supplier Part Number 1: 621-AP2112K-3.3TRG1
U?#5 = IP5219: 2.1A充电2.4A放电集成TYPE_C协议移动电源SOC; Manufacturer: INJOINIC; Manufacturer Part Number: IP5219; Supplier 1: LCSC; Supplier Part Number 1: C181694
Y? = S3240000121040: 无源晶振 SMD3225 40.000MHZ 12PF 10PPM; Manufacturer: JGHC; Supplier 1: LCSC; Manufacturer Part Number: S3240000121040; RoHS: No; Stock 1: 3825; Pricing 1: 5=0.0669, 50=0.0535, 150=0.0468, 500=0.0418, 3000=0.0378, 6000=0.0358 (USD); Supplier Part Number 1: C426989